# Altium schematic sheet M5_Display_COMM.SchDoc
size A4
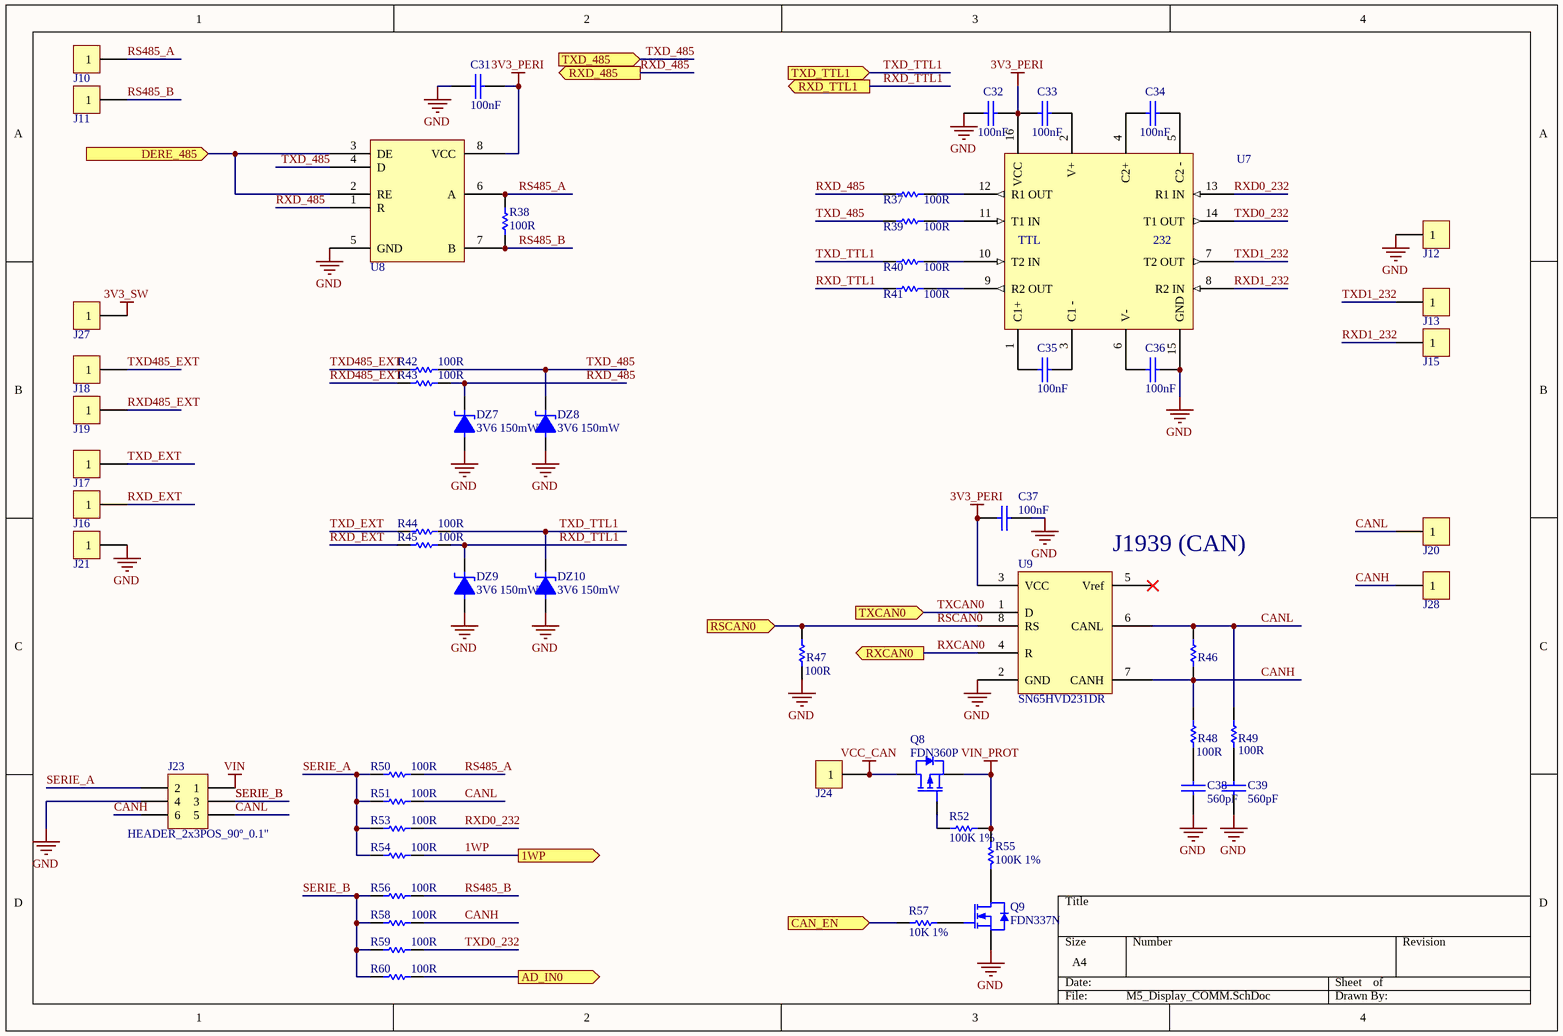
[diagram p0: M5_Display_COMM.SchDoc]

## Parts
C31  100nF  [0402]
C32  100nF  [0402]
C33  100nF  [0402]
C34  100nF  [0402]
C35  100nF  [0402]
C36  100nF  [0402]
C37  100nF  [0402]
C38  560pF  [0402]
C39  560pF  [0402]
DZ7  3V6 150mW  [SOD523]
DZ8  3V6 150mW  [SOD523]
DZ9  3V6 150mW  [SOD523]
DZ10  3V6 150mW  [SOD523]
J10  PIN CABLE  [PIN_CABLE]  (value not drawn)  (no BOM)
J11  PIN CABLE  [PIN_CABLE]  (value not drawn)  (no BOM)
J12  PIN CABLE  [PIN_CABLE]  (value not drawn)  (no BOM)
J13  PIN CABLE  [PIN_CABLE]  (value not drawn)  (no BOM)
J15  PIN CABLE  [PIN_CABLE]  (value not drawn)  (no BOM)
J16  PIN CABLE  [PIN_CABLE]  (value not drawn)  (no BOM)
J17  PIN CABLE  [PIN_CABLE]  (value not drawn)  (no BOM)
J18  PIN CABLE  [PIN_CABLE]  (value not drawn)  (no BOM)
J19  PIN CABLE  [PIN_CABLE]  (value not drawn)  (no BOM)
J20  PIN CABLE  [PIN_CABLE]  (value not drawn)  (no BOM)
J21  PIN CABLE  [PIN_CABLE]  (value not drawn)  (no BOM)
J23  HEADER_2x3POS_90º_0.1"  [SIP3_2_90]
J24  PIN CABLE  [PIN_CABLE]  (value not drawn)  (no BOM)
J27  PIN CABLE  [PIN_CABLE]  (value not drawn)  (no BOM)
J28  PIN CABLE  [PIN_CABLE]  (value not drawn)  (no BOM)
Q8  FDN360P  [SOT23]
Q9  FDN337N  [SOT23]
R37  100R  [0402]
R38  100R  [0402]
R39  100R  [0402]
R40  100R  [0402]
R41  100R  [0402]
R42  100R  [0402]
R43  100R  [0402]
R44  100R  [0402]
R45  100R  [0402]
R46  120R  [0402]  (value not drawn)
R47  100R  [0402]  (no BOM)
R48  100R  [0402]
R49  100R  [0402]
R50  100R  [0402]
R51  100R  [0402]  (no BOM)
R52  100K 1%  [0402]
R53  100R  [0402]  (no BOM)
R54  100R  [0402]  (no BOM)
R55  100K 1%  [0402]
R56  100R  [0402]
R57  10K 1%  [0402]
R58  100R  [0402]  (no BOM)
R59  100R  [0402]  (no BOM)
R60  100R  [0402]  (no BOM)
U7  ST3232ECDR  [SOIC16N]  (value not drawn)
U8  ST3485EBDR  [SO8]  (value not drawn)
U9  SN65HVD231DR  [SO8]

## Ports
1WP (out), AD_IN0 (out), CAN_EN (in), DERE_485 (in), RSCAN0 (in), RXCAN0 (out), RXD_485 (out), RXD_TTL1 (out), TXCAN0 (in), TXD_485 (in), TXD_TTL1 (in)

## Nets
3V3_PERI: C31.1 C32.2 C33.1 C37.1 U7.16(VCC) U8.8(VCC) U9.3(VCC)
3V3_SW: J27.1
GND: C31.2 C32.1 C36.2 C37.2 C38.1 C39.1 DZ7.1 DZ8.1 DZ9.1 DZ10.1 J12.1 J21.1 J23.4 Q9.3(S) R47.1 U7.15(GND) U8.5(GND) U9.2(GND)
VCC_CAN: J24.1 Q8.2(D)
VIN: J23.1
VIN_PROT: Q8.3(S) R52.2 R55.2
1WP: R54.2 ; port 1WP
AD_IN0: R60.2 ; port AD_IN0
CAN_EN: R57.2 ; port CAN_EN
CANH: J23.6 J28.1 R46.1 R48.2 R58.2 U9.7(CANH)
CANL: J20.1 J23.5 R46.2 R49.2 R51.2 U9.6(CANL)
DERE_485: U8.2(RE) U8.3(DE) ; port DERE_485
RS485_A: J10.1 R38.2 R50.2 U8.6(A)
RS485_B: J11.1 R38.1 R56.2 U8.7(B)
RSCAN0: R47.2 U9.8(RS) ; port RSCAN0
RXCAN0: U9.4(R) ; port RXCAN0
RXD0_232: R53.2 U7.13(R1_IN)
RXD1_232: J15.1 U7.8(R2_IN)
RXD485_EXT: J19.1 R43.1
RXD_485: DZ7.2 R37.1 R43.2 U8.1(R) ; port RXD_485
RXD_EXT: J16.1 R45.1
RXD_TTL1: DZ9.2 R41.1 R45.2 ; port RXD_TTL1
SERIE_A: J23.2 R50.1 R51.1 R53.1 R54.1
SERIE_B: J23.3 R56.1 R58.1 R59.1 R60.1
TXCAN0: U9.1(D) ; port TXCAN0
TXD0_232: R59.2 U7.14(T1_OUT)
TXD1_232: J13.1 U7.7(T2_OUT)
TXD485_EXT: J18.1 R42.1
TXD_485: DZ8.2 R39.2 R42.2 U8.4(D) ; port TXD_485
TXD_EXT: J17.1 R44.1
TXD_TTL1: DZ10.2 R40.1 R44.2 ; port TXD_TTL1
NetC33_2: C33.2 U7.2(V+)
NetC34_1: C34.1 U7.4(C2+)
NetC34_2: C34.2 U7.5(C2_-)
NetC35_1: C35.1 U7.1(C1+)
NetC35_2: C35.2 U7.3(C1_-)
NetC36_1: C36.1 U7.6(V-)
NetC38_2: C38.2 R48.1
NetC39_2: C39.2 R49.1
NetQ8_1: Q8.1(G) R52.1
NetQ9_1: Q9.1(G) R57.1
NetQ9_2: Q9.2(D) R55.1
NetR37_2: R37.2 U7.12(R1_OUT)
NetR39_1: R39.1 U7.11(T1_IN)
NetR40_2: R40.2 U7.10(T2_IN)
NetR41_2: R41.2 U7.9(R2_OUT)

Not connected (* = marked no-connect by the designer): U9 5(Vref)*

## Notes on the sheet
- (near U9) J1939 (CAN)
- (in symbol ST3232_SOIC16N) TTL; 232

## Library data of the parts
C31 = CAP0402_100nF_50V_X7R: CAP0402 100nF 50V X7R; Manufacturer: TDK Corporation; Manufacturer Part Number: C1005X7R1H104K050BB; CREO: LL; Precio: 0; Part Number: CAP0402_100nF_50V_X7R; Value: 100nF; Digikey PN: 445-5932-2-ND; Supplier 1: Digi-Key; Supplier Part Number 1: 445-5932-2-ND
C32-C36 = CAP0402_100nF_50V_X7R: CAP0402 100nF 50V X7R; Manufacturer: TDK Corporation; Manufacturer Part Number: C1005X7R1H104K050BB; CREO: LL; Part Number: CAP0402_100nF_50V_X7R; Value: 100nF; Supplier 1: Digi-Key; Supplier Part Number 1: 445-5932-2-ND
C37 = CAP0402_100nF_50V_X7R: CAP0402 100nF 50V X7R; CREO: LL; Precio: 0; Part Number: CAP0402_100nF_50V_X7R; Value: 100nF; Digikey PN: 445-5932-2-ND
C38 C39 = CAP0402_560pF_NP0: CAP0402 560pF 50V NP0; CREO: EB; Precio: 0; Part Number: CAP0402_560pF_NP0; Value: 560pF; Digikey PN: 445-7326-2-ND
DZ7-DZ10 = DIO_ZEN_3V6_SOD523: DIODE ZENER 3.6V 150MW SSMINI2 SOD523; Manufacturer: Panasonic Electronic Components; Manufacturer Part Number: DZ2S036M0L; CREO: EB; Part Number: DIO_ZEN_3V6_SOD523; Value: 3V6 150mW; Supplier 1: Digi-Key; Supplier Part Number 1: DZ2S036M0LCT-ND
J10-J13 J15-J21 J24 J27 J28 = PIN_1_CABLE_1mm: PIN PARA SOLDAR CABLE 1MM; Publico: EB; Part Number: PIN_1_CABLE_1mm; Value: PIN CABLE; Aprobo: -
J23 = HEADER_2x3POS_90º_0.1": TIRA PINES MACHO 2X3 0,1'' 90º; Publico: EB; Precio: 0; Part Number: HEADER_2x3POS_90º_0.1"; Value: HEADER_2x3POS_90º_0.1"; Digikey PN: PROVISTO POR EC; Aprobo: -; Supplier 1: ElectroComponentes
Q8 = FDN360P_SOT23: MOSFET P 30V 2A SSOT3; Publico: EB; Part Number: FDN360P_SOT23; Value: FDN360P; Supplier 1: Digi-Key; Supplier Part Number 1: FDN360PCT-ND; Aprobo: -
Q9 = FDN337N_SOT23: MOSFET N-CH 30V 2.2A SSOT3; Publico: EB; Part Number: FDN337N_SOT23; Value: FDN337N; Supplier 1: Digi-Key; Supplier Part Number 1: FDN337NCT-ND; Aprobo: -
R37 R39-R41 R47-R49 = RES0402_100R_5%: RES0402 100R 5%; Manufacturer: Stackpole Electronics Inc; Manufacturer Part Number: RMCF0402JT100R; Publico: EB; Part Number: RES0402_100R_5%; Value: 100R; Supplier 1: Digi-Key; Supplier Part Number 1: RMCF0402JT100RCT-ND; Aprobo: -
R38 R42-R45 R50 R51 R53 R54 R56 R58-R60 = RES0402_100R_5%: RES0402 100R 5%; Manufacturer: Stackpole Electronics Inc; Manufacturer Part Number: RMCF0402JT100R; Publico: EB; Precio: 0; Part Number: RES0402_100R_5%; Value: 100R; Digikey PN: RMCF0402JT100RCT-ND; Aprobo: -; Supplier 1: Digi-Key; Supplier Part Number 1: RMCF0402JT100RCT-ND
R46 = RES0402_120R_5%: RES0402 120R 5%; Manufacturer: Stackpole Electronics Inc; Manufacturer Part Number: RMCF0402JT120R; Publico: EB; Part Number: RES0402_120R_5%; Value: 120R; Supplier 1: Digi-Key; Supplier Part Number 1: RMCF0402JT120RCT-ND; Aprobo: -
R52 R55 = RES0402_100K_1%: RES0402 100K 1%; Manufacturer: Stackpole Electronics Inc; Manufacturer Part Number: RMCF0402FT100K; Publico: EB; Part Number: RES0402_100K_1%; Value: 100K 1%; Supplier 1: Digi-Key; Supplier Part Number 1: RMCF0402FT100KCT-ND; Aprobo: -
R57 = RES0402_10K_1%: RES0402 10K 1%; Publico: EB; Precio: 0; Part Number: RES0402_10K_1%; Value: 10K 1%; Digikey PN: RMCF0402FT10K0TR-ND; Aprobo: -; Supplier 1: Digi-Key; Supplier Part Number 1: RMCF0402FT10K0TR-ND
U7 = ST3232_SOIC16N: IC DRVR/RCVR RS232 ESD 16-SOIC; Manufacturer: STMicroelectronics; Publico: EB; Part Number: ST3232_SOIC16N; Value: ST3232ECDR; Manufacturer Part Number: ST3232ECDR; Supplier 1: Digi-Key; Supplier Part Number 1: 497-6537-1-ND; Aprobo: -
U8 = ST3485_SO8: IC TXRX 3.3V RS485/422 8 SOIC; Manufacturer: STMicroelectronics; Publico: EB; Part Number: ST3485_SO8; Value: ST3485EBDR; Manufacturer Part Number: ST3485EBDR; Supplier 1: Digi-Key; Supplier Part Number 1: 497-2080-1-ND; Aprobo: -
U9 = SN65HVD231_SO8: IC CAN TRANSCEIVER W/ SLEEP MODE 3.3V 8-SOIC; Publico: EB; Precio: 0; Part Number: SN65HVD231_SO8; Value: SN65HVD231DR; Digikey PN: 296-26343-2-ND; Aprobo: -